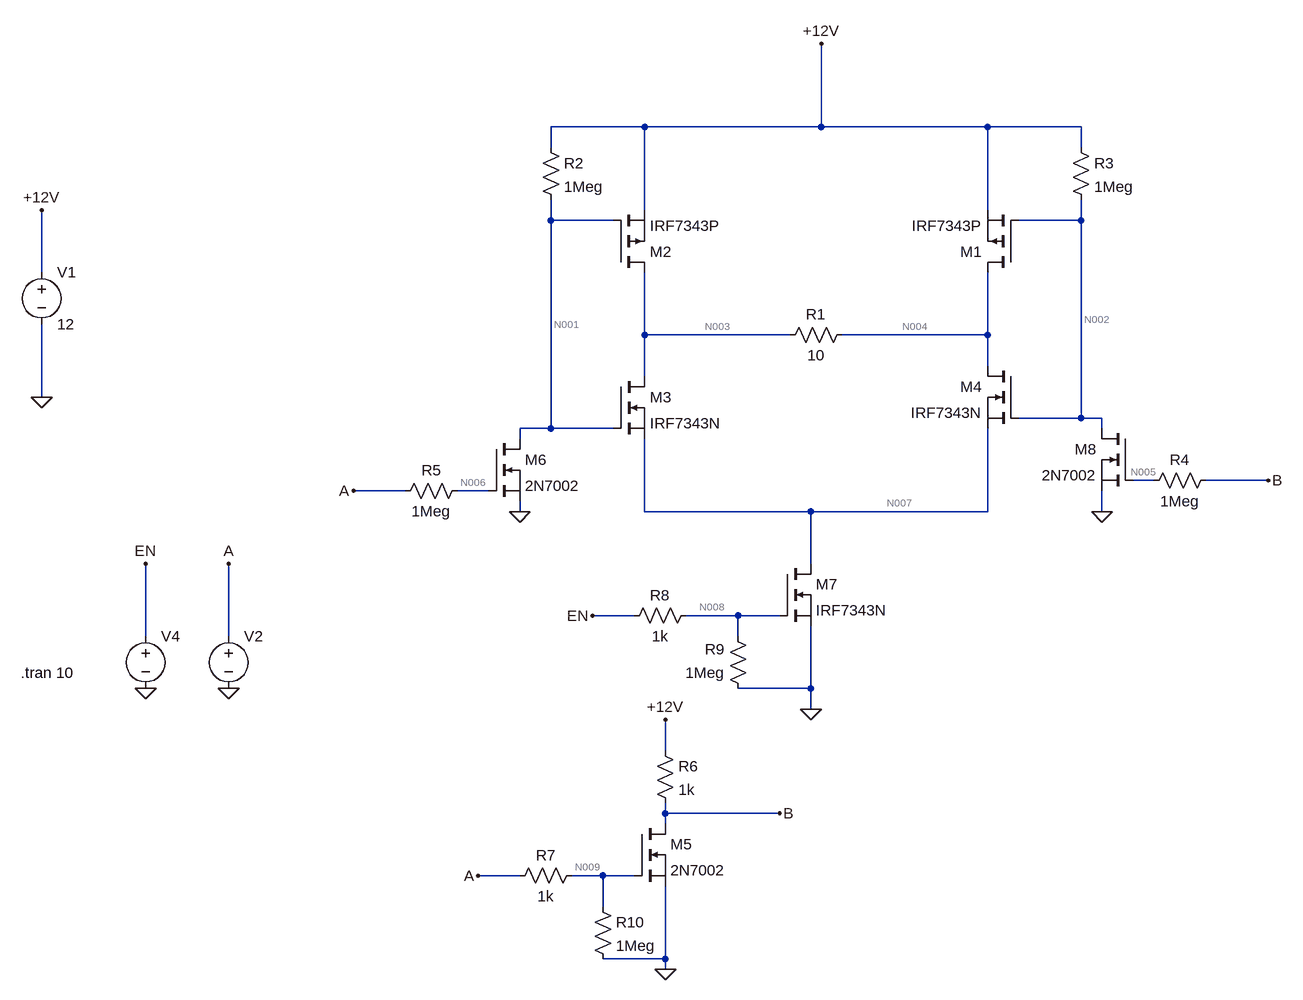
[diagram p0: schematic Beefy H-Bridge.asc]
Beefy H-Bridge.asc, the LTspice schematic file:
Version 4
SHEET 1 2052 980
WIRE -32 -336 -176 -336
WIRE 240 -336 240 -464
WIRE 240 -336 -32 -336
WIRE 496 -336 240 -336
WIRE 640 -336 496 -336
WIRE -176 -304 -176 -336
WIRE 640 -304 640 -336
WIRE -32 -208 -32 -336
WIRE 496 -208 496 -336
WIRE -176 -192 -176 -224
WIRE -80 -192 -176 -192
WIRE 640 -192 640 -224
WIRE 640 -192 544 -192
WIRE -960 -112 -960 -208
WIRE -32 -16 -32 -112
WIRE 192 -16 -32 -16
WIRE 496 -16 496 -112
WIRE 496 -16 272 -16
WIRE 496 32 496 -16
WIRE -32 48 -32 -16
WIRE -960 80 -960 -32
WIRE 640 112 640 -192
WIRE 640 112 544 112
WIRE 672 112 640 112
WIRE -176 128 -176 -192
WIRE -176 128 -224 128
WIRE -80 128 -176 128
WIRE 672 128 672 112
WIRE -224 144 -224 128
WIRE 752 208 720 208
WIRE 928 208 832 208
WIRE -400 224 -480 224
WIRE -272 224 -320 224
WIRE -224 256 -224 240
WIRE -32 256 -32 144
WIRE 224 256 -32 256
WIRE 496 256 496 128
WIRE 496 256 224 256
WIRE 672 256 672 224
WIRE 224 336 224 256
WIRE -48 416 -112 416
WIRE 112 416 32 416
WIRE 176 416 112 416
WIRE -800 448 -800 336
WIRE -672 448 -672 336
WIRE 112 448 112 416
WIRE 224 528 224 432
WIRE 224 528 112 528
WIRE 224 560 224 528
WIRE 0 624 0 576
WIRE 0 720 0 704
WIRE 176 720 0 720
WIRE 0 736 0 720
WIRE -224 816 -288 816
WIRE -96 816 -144 816
WIRE -48 816 -96 816
WIRE -96 864 -96 816
WIRE 0 944 0 832
WIRE 0 944 -96 944
WIRE 0 960 0 944
FLAG 224 560 0
FLAG -960 80 0
FLAG -960 -208 +12V
FLAG 240 -464 +12V
FLAG -480 224 A
FLAG 928 208 B
FLAG -672 528 0
FLAG -672 336 A
FLAG -112 416 EN
FLAG -800 528 0
FLAG -800 336 EN
FLAG 0 960 0
FLAG -288 816 A
FLAG 0 576 +12V
FLAG 176 720 B
FLAG -224 256 0
FLAG 672 256 0
SYMBOL nmos 544 32 M0
SYMATTR InstName M4
SYMATTR Value IRF7343N
SYMBOL res 288 -32 R90
WINDOW 0 0 56 VBottom 2
WINDOW 3 32 56 VTop 2
SYMATTR InstName R1
SYMATTR Value 10
SYMATTR SpiceLine tol=1 pwr=0.1
SYMBOL voltage -960 -128 R0
WINDOW 123 0 0 Left 2
WINDOW 39 0 0 Left 2
SYMATTR InstName V1
SYMATTR Value 12
SYMBOL res -192 -320 R0
SYMATTR InstName R2
SYMATTR Value 1Meg
SYMATTR SpiceLine tol=1 pwr=0.1
SYMBOL pmos 544 -112 R180
SYMATTR InstName M1
SYMATTR Value IRF7343P
SYMBOL pmos -80 -112 M180
SYMATTR InstName M2
SYMATTR Value IRF7343P
SYMBOL nmos -80 48 R0
SYMATTR InstName M3
SYMATTR Value IRF7343N
SYMBOL res 624 -320 R0
SYMATTR InstName R3
SYMATTR Value 1Meg
SYMATTR SpiceLine tol=1 pwr=0.1
SYMBOL res 848 192 R90
WINDOW 0 0 56 VBottom 2
WINDOW 3 32 56 VTop 2
SYMATTR InstName R4
SYMATTR Value 1Meg
SYMATTR SpiceLine tol=1 pwr=0.1
SYMBOL res -304 208 R90
WINDOW 0 0 56 VBottom 2
WINDOW 3 32 56 VTop 2
SYMATTR InstName R5
SYMATTR Value 1Meg
SYMATTR SpiceLine tol=1 pwr=0.1
SYMBOL voltage -672 432 R0
WINDOW 3 24 96 Invisible 2
WINDOW 123 0 0 Left 2
WINDOW 39 0 0 Left 2
SYMATTR Value PULSE(5 0 0 0.0000001 0.0000001 1 2 100)
SYMATTR InstName V2
SYMBOL nmos 176 336 R0
SYMATTR InstName M7
SYMATTR Value IRF7343N
SYMBOL voltage -800 432 R0
WINDOW 3 24 96 Invisible 2
WINDOW 123 0 0 Left 2
WINDOW 39 0 0 Left 2
SYMATTR Value PULSE(5 0 0 0.0000001 0.0000001 5 10 10)
SYMATTR InstName V4
SYMBOL res -16 608 R0
SYMATTR InstName R6
SYMATTR Value 1k
SYMATTR SpiceLine tol=1 pwr=0.1
SYMBOL res -128 800 R90
WINDOW 0 0 56 VBottom 2
WINDOW 3 32 56 VTop 2
SYMATTR InstName R7
SYMATTR Value 1k
SYMATTR SpiceLine tol=1 pwr=0.1
SYMBOL res 128 544 R180
WINDOW 0 36 76 Left 2
WINDOW 3 36 40 Left 2
SYMATTR InstName R9
SYMATTR Value 1Meg
SYMATTR SpiceLine tol=1 pwr=0.1
SYMBOL res -64 432 R270
WINDOW 0 32 56 VTop 2
WINDOW 3 0 56 VBottom 2
SYMATTR InstName R8
SYMATTR Value 1k
SYMATTR SpiceLine tol=1 pwr=0.1
SYMBOL res -112 848 R0
SYMATTR InstName R10
SYMATTR Value 1Meg
SYMATTR SpiceLine tol=1 pwr=0.1
SYMBOL nmos -48 736 R0
SYMATTR InstName M5
SYMATTR Value 2N7002
SYMBOL nmos -272 144 R0
SYMATTR InstName M6
SYMATTR Value 2N7002
SYMBOL nmos 720 128 M0
SYMATTR InstName M8
SYMATTR Value 2N7002
TEXT -992 504 Left 2 !.tran 10

The netlist it stands for:
* Beefy H-Bridge.asc
M4 N004 N002 N007 N007 IRF7343N
R1 N004 N003 10 tol=1 pwr=0.1
V1 +12V 0 12
R2 +12V N001 1Meg tol=1 pwr=0.1
M1 N004 N002 +12V +12V IRF7343P
M2 N003 N001 +12V +12V IRF7343P
M3 N003 N001 N007 N007 IRF7343N
R3 +12V N002 1Meg tol=1 pwr=0.1
R4 B N005 1Meg tol=1 pwr=0.1
R5 N006 A 1Meg tol=1 pwr=0.1
V2 A 0 PULSE(5 0 0 0.0000001 0.0000001 1 2 100)
M7 N007 N008 0 0 IRF7343N
V4 EN 0 PULSE(5 0 0 0.0000001 0.0000001 5 10 10)
R6 +12V B 1k tol=1 pwr=0.1
R7 N009 A 1k tol=1 pwr=0.1
R9 0 N008 1Meg tol=1 pwr=0.1
R8 EN N008 1k tol=1 pwr=0.1
R10 N009 0 1Meg tol=1 pwr=0.1
M5 B N009 0 0 2N7002
M6 N001 N006 0 0 2N7002
M8 N002 N005 0 0 2N7002
.model NMOS NMOS
.model PMOS PMOS
.lib standard.mos
.tran 10
.backanno
.end

* Results of the author's LTspice run, read from the files saved beside the schematic
* Operating Point, zero values left out:
*   V(n004) = 122 mV
*   V(n002) = 12 V
*   V(n007) = 70.39 mV
*   V(n003) = 11.81 V
*   V(+12v) = 12 V
*   V(n001) = 25.61 µV
*   V(b) = 25.67 mV
*   V(n005) = 25.67 mV
*   V(n006) = 5 V
*   V(a) = 5 V
*   V(n008) = 4.995 V
*   V(en) = 5 V
*   V(n009) = 4.995 V
*   Id(M8) = 12.03 pA
*   Is(M8) = -12.03 pA
*   Id(M6) = 12 µA
*   Is(M6) = -12 µA
*   Id(M5) = 11.97 mA
*   Is(M5) = -11.97 mA
*   Id(M2) = -1.169 A
*   Is(M2) = 1.169 A
*   Id(M1) = -87.88 pA
*   Is(M1) = 87.88 pA
*   Id(M7) = 1.169 A
*   Is(M7) = -1.169 A
*   Id(M3) = 83.77 pA
*   Is(M3) = -83.77 pA
*   Id(M4) = 1.169 A
*   Is(M4) = -1.169 A
*   I(R10) = 4.995 µA
*   I(R8) = 4.995 µA
*   I(R9) = -4.995 µA
*   I(R7) = -4.995 µA
*   I(R6) = 11.97 mA
*   I(R3) = 24.03 pA
*   I(R2) = 12 µA
*   I(R1) = -1.169 A
*   I(V4) = -4.995 µA
*   I(V2) = -4.995 µA
*   I(V1) = -1.181 A
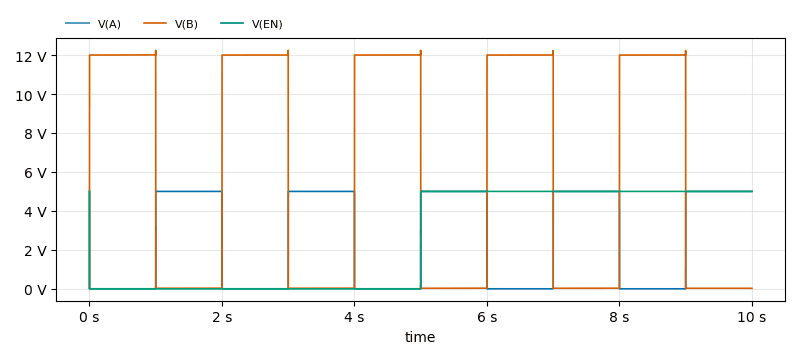
[diagram p1: Transient Analysis of Beefy H-Bridge.asc, plotted from the saved traces]
* Transient Analysis, 1 run:
*   V(A): min 0 V, max 5 V, average 2.5 V, rms 3.536 V, last 5 V
*   V(B): min 24.39 mV, max 12.24 V, average 6.013 V, rms 8.485 V, last 25.67 mV
*   V(EN): min 0 V, max 5 V, average 2.5 V, rms 3.536 V, last 5 V